# Altium schematic sheet Voeding.SchDoc
size A3; SheetNumber: 2; SheetTotal: 8
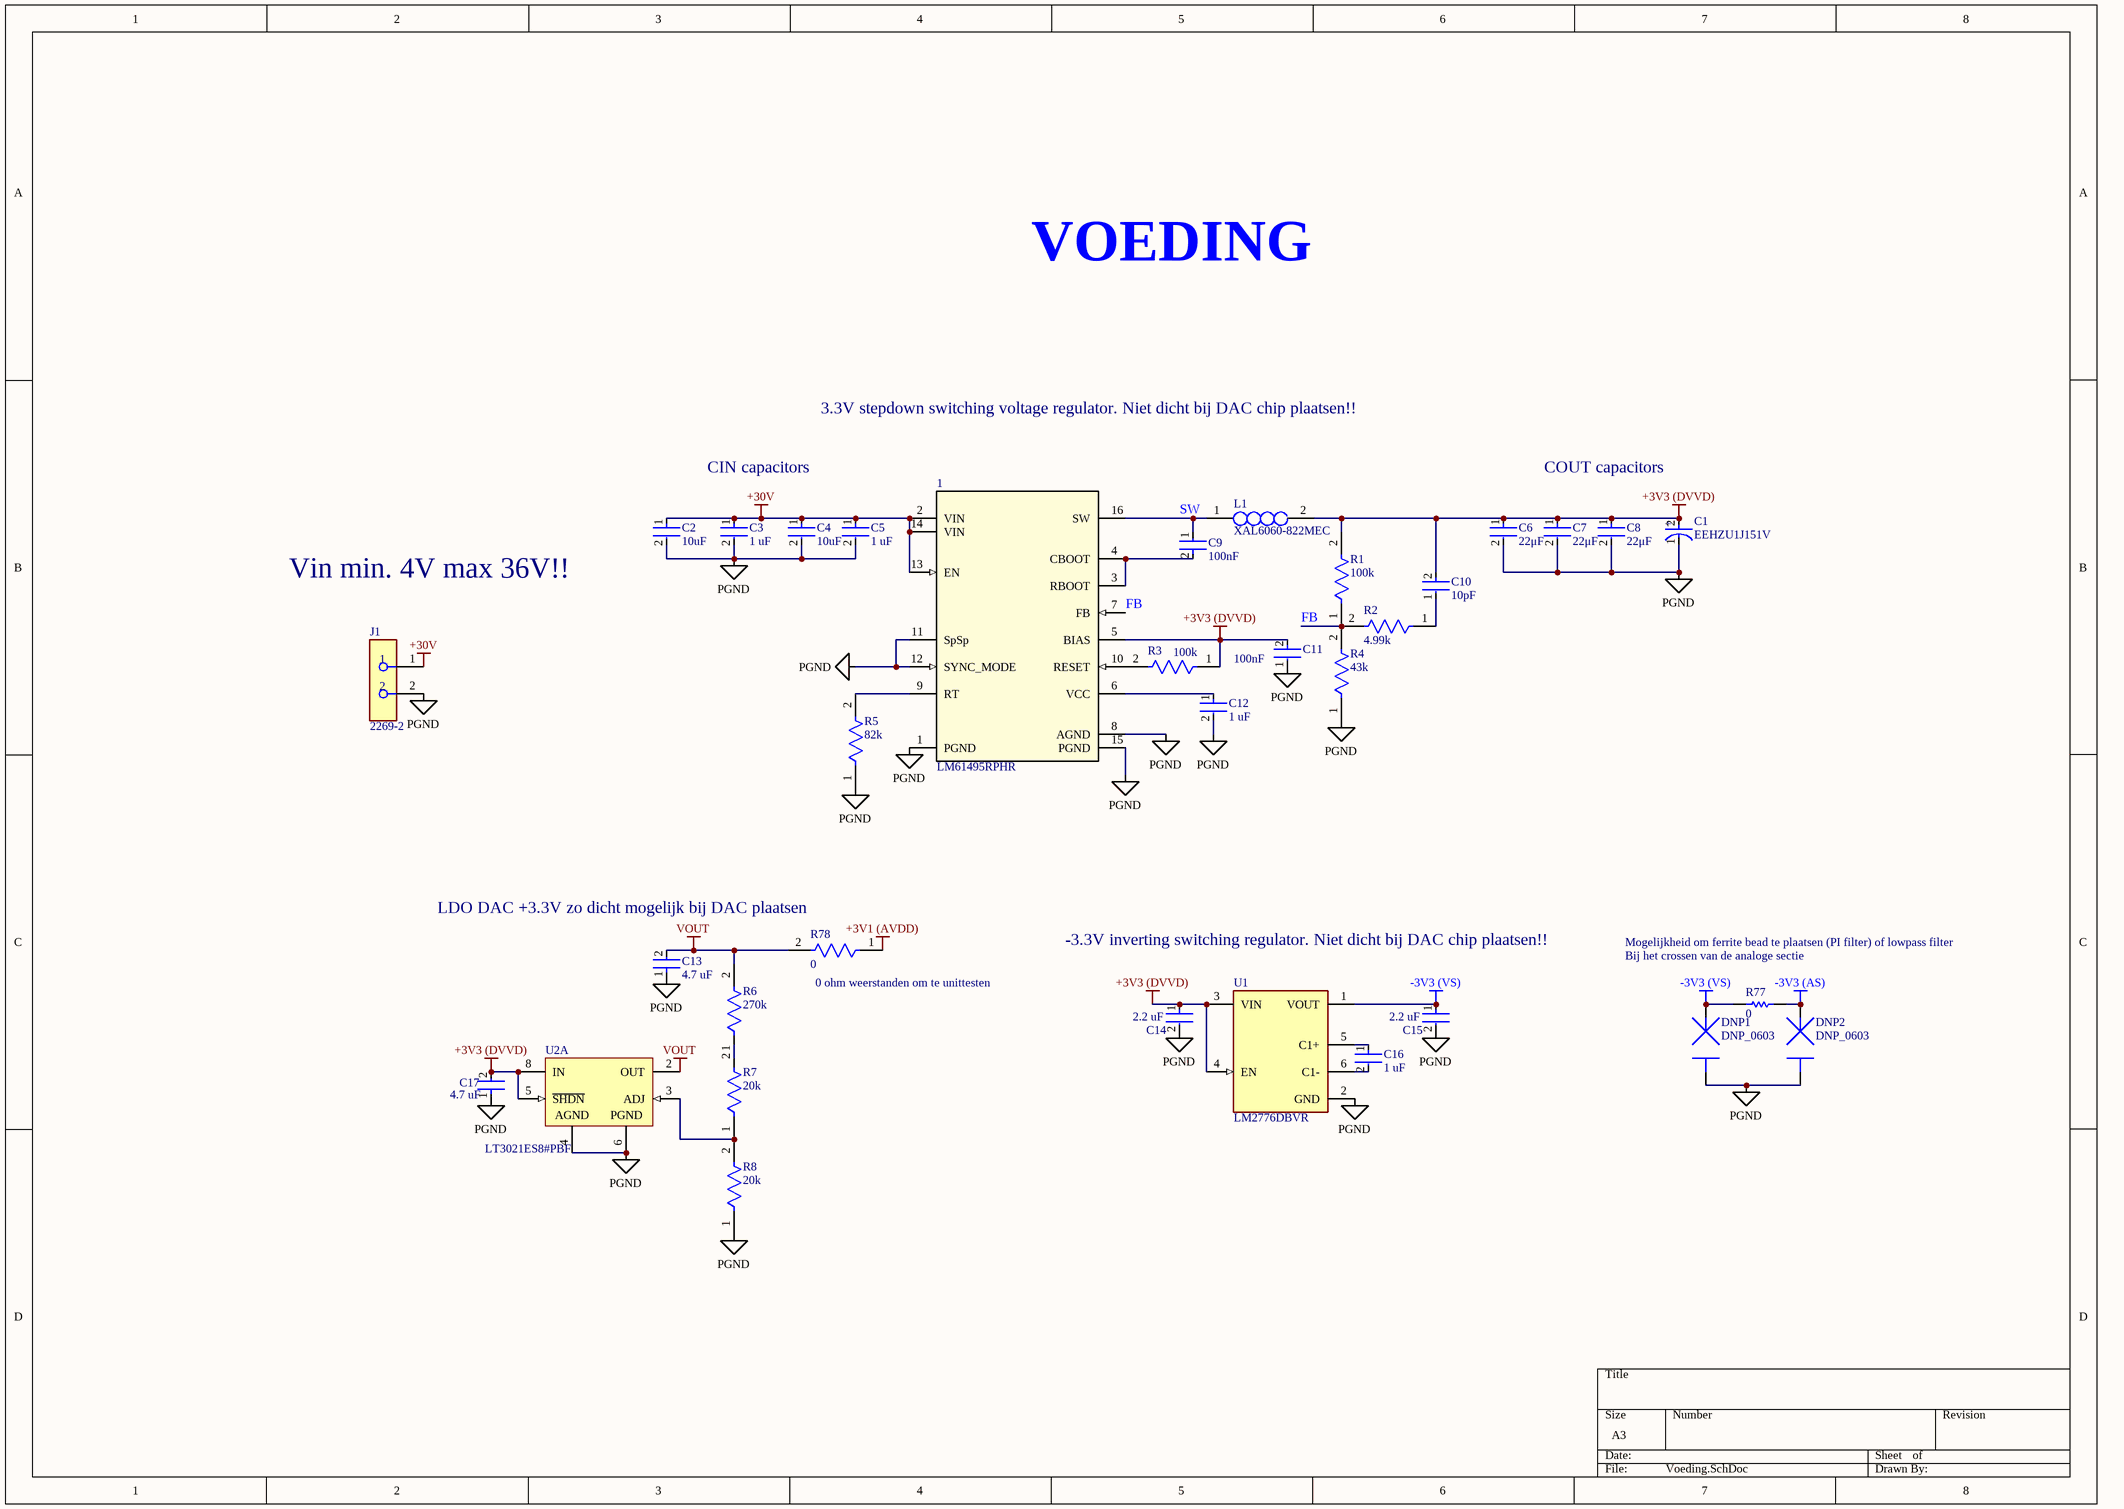
[diagram p0: Voeding.SchDoc]

## Parts
1  LM61495RPHR  [RPH0016A]
C1  EEHZU1J151V  [FP-EEH-G16-V-MFG]
C2  10uF  [FP-GRM32-MFG]
C3  1 uF  [FP-C0603C-CF-MFG]
C4  10uF  [FP-GRM32-MFG]
C5  1 uF  [FP-C0603C-CF-MFG]
C6  22μF  [FP-C2012-125-0_2-MFG]
C7  22μF  [FP-C2012-125-0_2-MFG]
C8  22μF  [FP-C2012-125-0_2-MFG]
C9  100nF  [FP-GRM15-MFG]
C10  10pF  [FP-GRM15-MFG]
C11  100nF  [FP-GRM15-MFG]
C12  1 uF  [FP-C0603C-CF-MFG]
C13  4.7 uF  [FP-C0603C-CF-MFG]
C14  2.2 uF  [FP-C0603C-CF-MFG]
C15  2.2 uF  [FP-C0603C-CF-MFG]
C16  1 uF  [FP-C0603C-CF-MFG]
C17  4.7 uF  [FP-C0603C-CF-MFG]
DNP1  DNP_0603  [DNP_0603_footprint]
DNP2  DNP_0603  [DNP_0603_footprint]
J1  2269-2  [FP-2269-2-MFG]
L1  XAL6060-822MEC  [XAL6060822MEC]
R1  100k  [FP-CRCW0402-C-e3-MFG]
R2  4.99k  [FP-CRCW0402-e3-MFG]
R3  100k  [FP-CRCW0402-C-e3-MFG]
R4  43k  [FP-CRCW0402-C-e3-MFG]
R5  82k  [FP-CRCW0402-C-e3-MFG]
R6  270k  [FP-ERJ6EN-MFG]
R7  20k  [FP-ERJ6EN-MFG]
R8  20k  [FP-ERJ6EN-MFG]
R77  0  [RESC1608X55X25ML10T15]
R78  0  [FP-CRCW1206-MFG]
U1  LM2776DBVR  [FP-DBV0006A-MFG]
U2  LT3021ES8#PBF  [LT-S8-8_L]  (part A of 2)

## Nets
+3V1 (AVDD): R78.1
+3V3 (DVVD): 1.5(BIAS) C1.2(A) C6.1 C7.1 C8.1 C10.2 C11.2 C14.1 C17.2 L1.2 R1.2 R3.1 U1.3(VIN) U1.4(EN) U2.5(~{SHDN}) U2.8(IN)
+30V: 1.2(VIN) 1.13(EN) 1.14(VIN) C2.1 C3.1 C4.1 C5.1 J1.1
-3V3 (AS): DNP2.2 R77.2
-3V3 (VS): C15.1 DNP1.2 R77.1 U1.1(VOUT)
PGND: 1.1(PGND) 1.8(AGND) 1.11(SpSp) 1.12(SYNC_MODE) 1.15(PGND) C1.1(C) C2.2 C3.2 C4.2 C5.2 C6.2 C7.2 C8.2 C11.1 C12.2 C13.1 C14.2 C15.2 C17.1 DNP1.1 DNP2.1 J1.2 R4.1 R5.1 R8.1 U1.2(GND) U2.4(AGND) U2.6(PGND)
VOUT: C13.2 R6.2 R78.2 U2.2(OUT)
FB: 1.7(FB) R1.1 R2.2 R4.2
SW: 1.16(SW) C9.1 L1.1
Net1_3: 1.3(RBOOT) 1.4(CBOOT) C9.2
Net1_6: 1.6(VCC) C12.1
Net1_9: 1.9(RT) R5.2
Net1_10: 1.10(RESET) R3.2
NetC10_1: C10.1 R2.1
NetC16_1: C16.1 U1.5(C1+)
NetC16_2: C16.2 U1.6(C1-)
NetR6_1: R6.1 R7.2
NetR7_1: R7.1 R8.2 U2.3(ADJ)

## Notes on the sheet
- VOEDING
- 3.3V stepdown switching voltage regulator. Niet dicht bij DAC chip plaatsen!!
- CIN capacitors
- COUT capacitors
- Vin min. 4V max 36V!!
- LDO DAC +3.3V zo dicht mogelijk bij DAC plaatsen
- (near R78) 0 ohm weerstanden om te unittesten
- -3.3V inverting switching regulator. Niet dicht bij DAC chip plaatsen!!
- Mogelijkheid om ferrite bead te plaatsen (PI filter) of lowpass filter
- Bij het crossen van de analoge sectie
- (in symbol CMP-05428-001018-1) +

## Library data of the parts
1 = LM61495RPHR: No Description Available; Mfr_Name: Texas Instruments; TYPE: TYPE; RefDes: RefDes
C1 = CMP-05428-001018-1: Aluminum Hybrid Polymer Capacitors 150uF 20% 63V Life 4000Hours AEC-Q200 RADIAL SMT; RoHS Compliant: Yes
C2 C4 = CMP-2000-05261-2: CAP CER 10UF 50V X7R 1210; Manufacturer Part Number: GRM32ER71H106KA12L; Manufacturer: Murata; Tolerance: 10%; Material: Ceramic; Temperature Coefficient: 15%; Voltage Rating: 50V; Temperature Characteristic: X7R; Value: 10uF; ComponentLink2Description: Datasheet; Device Class L1: Passive Components; Lead Free: Yes; Temperature Range High: +125°C; Category: Cap; ComponentLink2URL: https://search.murata.co.jp/Ceramy/image/img/A01X/G101/ENG/GRM32ER71H106KA12-01.pdf; Device Class L2: Capacitors; Package: GRM32; Mouser Description: 1210 10 uF 50 V ±10% Tolerance X7R SMT Multilayer Ceramic Capacitor; Capacitance: 10uF; Octopart: https://octopart.com/grm32er71h106ka12l-murata-10470987; Digikey Description: CAP CER 10UF 50V X7R 1210; Height: 2.7mm; Temperature: -55°C to +125°C; Temperature Range Low: -55°C; RoHS: TRUE; Device Class L3: Ceramic Capacitors; Automotive: No
C3 C5 C12 C16 = CMP-2006-03056-2: CAP CER 1 UF 50V 5% X7R 0603; Manufacturer Part Number: C0603C104J5RACTU; Manufacturer: KEMET; Generic part Eurocircuits:: GPC0603105; Automotive Grade: Grade 1; Tolerance: 0.05; Capacitance: 1 μF; Value: 1 μF; Material: Ceramic; Temperature Coefficient: 30ppm/°C; ComponentLink2Description: Datasheet; Voltage Rating: 50 V; Digikey Description: CAP CER 0.1UF 50V 5% X7R 0603; Temperature Range High: +125°C; Device Class L2: Capacitors; Octopart: https://octopart.com/c0603c104j5ractu-kemet-10440638; RoHS: TRUE; Mouser Description: Multilayer Ceramic Capacitors MLCC - SMD/SMT 50volts 0.1uF X7R 5%; Temperature Range Low: -55°C; Automotive: Yes; Lead Free: Yes; ComponentLink2URL: https://api.kemet.com/component-edge/download/datasheet/C0603C100J5GACAUTO.pdf; Device Class L3: Ceramic Capacitors; Package: C0603C-CF; Category: Cap; Temperature: -55°C to +125°C; Height: 0.87mm; Temperature Characteristic: X7R; Device Class L1: Passive Components
C6-C8 = CMP-08246-005813-1: Multilayer Ceramic Capacitors 22μF ±20% 10V X5R SMD 0805; Capacitance: 22uF; Termination: SMD/SMT; Width: 0.049inch; Dielectric: X5R; Tolerance: 20%; Resistor Type: Ceramic; Construction: Flat; Package Quantity: 1; Mount: Surface Mount; Packaging: Tape and Reel; Case Code (Imperial): 0805; Dielectric Material: Ceramic; Case/Package: 0805; Series: C; Voltage Rating (DC): 10V; Min Operating Temperature: -55°C; Lead Free: Lead Free; Weight: 0.000194oz; Thickness: 0.057inch; RoHS Compliant: Yes; REACH SVHC: No SVHC; Depth: 1.25mm; Max Operating Temperature: 85°C; Length: 2mm; Number of Pins: 2; Case Code (Metric): 2012; Voltage Rating: 10V; Height: 1.25mm
C9 C11 = CMP-2100-03641-2: CAP CER 0.1UF 16V X7R 0402; Manufacturer Part Number: GRM155R71C104KA88D; Manufacturer: Murata; Standoff Height: 0mm; Tolerance: 10%; Voltage Rating: 16Vdc; Material: Ceramic; Capacitance: 0.10μF; Value: 0.10μF; RoHS: TRUE; Temperature Characteristic: X7R; Octopart: https://octopart.com/grm155r71c104ka88d-murata-196880; Digikey Description: CAP CER 0.1UF 16V X7R 0402; Device Class L3: Ceramic Capacitors; Height: 0.55mm; ComponentLink2Description: Datasheet; Temperature Range Low: -55°C; Ipc Land Pattern Name: CAPC10050X219; ComponentLink2URL: https://search.murata.co.jp/Ceramy/image/img/A01X/G101/ENG/GRM155R71H471KA01-01A.pdf; Device Class L1: Passive Components; Lead Free: yes; Category: Cap; Package: GRM15; Temperature: -55°C to +125°C; Device Class L2: Capacitors; Temperature Range High: +125°C; Mouser Description: 0402 0.1 uF 16V ±10 % Tolerance X7R SMT Multilayer Ceramic Capacitor
C10 = CMP-2100-03641-2: CAP CER 10pF 16V X7R 0402; Manufacturer Part Number: GRM155R71C104KA88D; Manufacturer: Murata; Standoff Height: 0mm; Tolerance: 10%; Voltage Rating: 16Vdc; Material: Ceramic; RoHS: TRUE; Temperature Characteristic: X7R; Octopart: https://octopart.com/grm155r71c104ka88d-murata-196880; Digikey Description: CAP CER 0.1UF 16V X7R 0402; Device Class L3: Ceramic Capacitors; Height: 0.55mm; ComponentLink2Description: Datasheet; Temperature Range Low: -55°C; Ipc Land Pattern Name: CAPC10050X219; ComponentLink2URL: https://search.murata.co.jp/Ceramy/image/img/A01X/G101/ENG/GRM155R71H471KA01-01A.pdf; Device Class L1: Passive Components; Lead Free: yes; Category: Cap; Package: GRM15; Temperature: -55°C to +125°C; Device Class L2: Capacitors; Capacitance: 10pF; Value: 10pF; Temperature Range High: +125°C; Mouser Description: 0402 0.1 uF 16V ±10 % Tolerance X7R SMT Multilayer Ceramic Capacitor
C13 C17 = CMP-2006-03056-2: CAP CER 4.7 UF 50V 5% X7R 0603; Manufacturer Part Number: C0603C104J5RACTU; Manufacturer: KEMET; Generic part Eurocircuits:: GPC0603475-10; Automotive Grade: Grade 1; Tolerance: 0.05; Capacitance: 4.7 μF; Value: 4.7 μF; Material: Ceramic; Temperature Coefficient: 30ppm/°C; ComponentLink2Description: Datasheet; Voltage Rating: 50 V; Digikey Description: CAP CER 0.1UF 50V 5% X7R 0603; Temperature Range High: +125°C; Device Class L2: Capacitors; Octopart: https://octopart.com/c0603c104j5ractu-kemet-10440638; RoHS: TRUE; Mouser Description: Multilayer Ceramic Capacitors MLCC - SMD/SMT 50volts 0.1uF X7R 5%; Temperature Range Low: -55°C; Automotive: Yes; Lead Free: Yes; ComponentLink2URL: https://api.kemet.com/component-edge/download/datasheet/C0603C100J5GACAUTO.pdf; Device Class L3: Ceramic Capacitors; Package: C0603C-CF; Category: Cap; Temperature: -55°C to +125°C; Height: 0.87mm; Temperature Characteristic: X7R; Device Class L1: Passive Components
C14 C15 = CMP-2006-03056-2: CAP CER 2.2 UF 50V 5% X7R 0603; Manufacturer Part Number: C0603C104J5RACTU; Manufacturer: KEMET; Generic part Eurocircuits:: GPC0603105; Automotive Grade: Grade 1; Tolerance: 0.05; Capacitance: 2.2 μF; Value: 2.2 μF; Material: Ceramic; Temperature Coefficient: 30ppm/°C; ComponentLink2Description: Datasheet; Voltage Rating: 50 V; Digikey Description: CAP CER 0.1UF 50V 5% X7R 0603; Temperature Range High: +125°C; Device Class L2: Capacitors; Octopart: https://octopart.com/c0603c104j5ractu-kemet-10440638; RoHS: TRUE; Mouser Description: Multilayer Ceramic Capacitors MLCC - SMD/SMT 50volts 0.1uF X7R 5%; Temperature Range Low: -55°C; Automotive: Yes; Lead Free: Yes; ComponentLink2URL: https://api.kemet.com/component-edge/download/datasheet/C0603C100J5GACAUTO.pdf; Device Class L3: Ceramic Capacitors; Package: C0603C-CF; Category: Cap; Temperature: -55°C to +125°C; Height: 0.87mm; Temperature Characteristic: X7R; Device Class L1: Passive Components
DNP1 DNP2 = DNP_0603: Is just 0603 footprint. So that you can solder 0603 components on it after you ordered youre PCB.
J1 = CMP-73906-000010-1: CONN DBL BANANA JACK TURRET; Voltage Rating (DC): 70V; Max Current Rating: 15A; Number of Contacts: 2; Voltage Rating: 2.5kV; Body Material: PC; Gender: Female; Insulation: Mating End Insulated; Housing Color: Red; Insulation Material: Polycarbonate; Contact Material: Brass; Termination: Solder; Height: 0.375inch; Orientation: Straight; Lead Free: Lead Free; Length: 24inch; Depth: 16mm; Current Rating: 15A; Width: 4inch; Contact Plating: Tin; Weight: 0.033lb; RoHS Compliant: Yes; REACH SVHC: No SVHC; Package Quantity: 5; Number of Ports: 2; Color: Red; Housing Material: Polycarbonate; Packaging: Bulk; Mount: Panel
L1 = XAL6060-822MEC: 8.2 uH Inductor; Manufacturer_Name: COILCRAFT; Datasheet Link: https://www.coilcraft.com/getmedia/ea51f14b-7f32-4dc6-8dfe-d4b70549040f/xal60xx.pdf; Height: 6.1mm; Manufacturer_Part_Number: XAL6060-822MEC; Mouser Part Number: 994-XAL6060-822MEC; Mouser Price/Stock: https://www.mouser.co.uk/ProductDetail/Coilcraft/XAL6060-822MEC?qs=zCSbvcPd3pZnGF7hddsKzw%3D%3D
R1 R3 R5 = CMP-02407-010951-1: RES 100K OHM 1% 1/16W 0402; Temperature Coefficient: 100ppm/°C; Power Rating: 62.5mW; Resistance: 100kR; Lead Free: Lead Free; Length: 1mm; Tolerance: 1%; Resistor Type: Thick Film; Contact Plating: Tin; Case/Package: SMD/SMT; Min Operating Temperature: -55°C; RoHS Compliant: Yes; Termination: Wraparound; Max Operating Temperature: 155°C; Mount: Surface Mount
R2 = CMP-2002-00057-2: RES Thick Film, 4.99kΩ, 1%, 0.063W, 100ppm/°C, 0402; Power Rating: 63mW; Resistance: 4.99kR; Voltage Rating: 50V; Package Quantity: 10; Max Power Dissipation: 63mW; Temperature Coefficient: 100ppm/°C; Lead Free: Lead Free; Mount: Surface Mount; Height: 0.35mm; Number of Terminations: 2; Contact Plating: Tin; Case/Package: 0402; Max Operating Temperature: 155°C; Case Code (Imperial): 0402; Weight: 2.3E-05oz; Width: 0.5mm; Features: Automotive AEC-Q200; Voltage Rating (DC): 50V; Tolerance: 1%; Min Operating Temperature: -55°C; Length: 1mm; Depth: 0.5mm; Military Standard: Not; Packaging: Tape and Reel; Radiation Hardening: No; Composition: Thick Film; Termination: SMD/SMT; Case Code (Metric): 1005
R4 = CMP-02407-010951-1: RES 43k OHM 1% 1/16W 0402; Temperature Coefficient: 100ppm/°C; Power Rating: 62.5mW; Lead Free: Lead Free; Length: 1mm; Tolerance: 1%; Resistor Type: Thick Film; Contact Plating: Tin; Case/Package: SMD/SMT; Min Operating Temperature: -55°C; RoHS Compliant: Yes; Termination: Wraparound; Max Operating Temperature: 155°C; Mount: Surface Mount; Resistance: 43k
R6-R8 = CMP-2001-00027-2: RES SMD 20K OHM 1% 1/8W 0805; Temperature Coefficient: 100ppm/°C; Voltage Rating: 150V; Power Rating: 125mW; Resistance: 20kR; Max Operating Temperature: 155°C; Number of Terminations: 2; RoHS Compliant: Yes; Case Code (Imperial): 0805; Packaging: Tape and Reel; Construction: Rectangular; Series: ERJ; Resistor Type: Thick Film; Lead Free: Lead Free; Package Quantity: 1; Case/Package: 0805; Features: Automotive AEC-Q200; REACH SVHC: No SVHC; Technology: THICK FILM; Width: 0.049inch; Length: 2mm; Depth: 1.25mm; Min Operating Temperature: -55°C; Case Code (Metric): 2012; Contact Plating: Tin; Termination: SMD/SMT; Resistance Tolerance: 1%; Height: 0.6mm; Working Voltage: 150V; Military Standard: Not; Max Power Dissipation: 125mW; Radiation Hardening: No; Tolerance: 1%; Voltage Rating (DC): 150V; Mount: Surface Mount
R77 = CMP-2100-03667-1: Chip Resistor, 0 Ohm, +/- 5%, 0.1 W, -55 to 155 degC, 0603 (1608 Metric), RoHS, Tape and Reel; Manufacturer: Yageo; Temperature Coefficient: 200ppm/degreesC; Voltage Rating: 50V; Power Rating: 100mW; Resistance: 0mOhm; Width: 0.8mm; Max Operating Temperature: 155degC; Tolerance: 5%; Package Reference: 0603; Height: 0.45mm; Depth: 0.8mm; Package Description: 2-Pin Surface Mount Device, Body 1.6 x 0.8 mm; Termination: SMD/SMT; Package Quantity: 5000; Case/Package: 0603; Case Code (Imperial): 0603; Radiation Hardening: No; Number of Pins: 2; Length: 1.6mm; Lead Free: LeadFree; Voltage Rating (DC): 50V; Military Standard: Not; Datasheet URL: http://www.yageo.com/NewPortal/yageodocoutput?fileName=/pdf/R-Chip/PYu-RC_Group_51_RoHS_L_5.pdf; Manufacturer URL: http://www.yageo.com/; Packaging: TapeandReel; Case Code (Metric): 1608; Min Operating Temperature: -55degC; Composition: ThickFilm; RoHSCompliant: true; Contact Plating: Tin; Datasheet Version: Rev. 5, 10/2016; REACH SVHC: NoSVHC
R78 = CMP-00030-39388935-1: CRCW12060000ZSTA Zero Ohm Resistor, Jumper, 1206 [3216 Metric], Thick Film, 250 mW, Surface Mount; Voltage Rating (DC): 200V; Max Power Dissipation: 250mW; Temperature Coefficient: 100ppm/°C; Resistance: 0Ω; Packaging: Cut Tape; Lead Free: Contains Lead; Height: 609.6µm; Military Standard: Not; Min Operating Temperature: -55°C; Weight: 10.007382mg; Depth: 1.6mm; Termination: SMD/SMT; Mount: Surface Mount; RoHS: Compliant; Case Code (Metric): 3216; Max Operating Temperature: 155°C; NexarPartId: 39388935; Length: 3.2mm; Features: Automotive AEC-Q200; Case Code (Imperial): 1206; Composition: Thick Film; Case/Package: 1206; Voltage Rating: 200V; Width: 1.6mm; Contact Plating: Lead, Tin; Number of Terminations: 2; REACH SVHC: Unknown; Power Rating: 250mW; Radiation Hardening: No
U1 = CMP-04918-000109-1: IC REG CHARGE PUMP INV SOT23; Manufacturer: Texas Instruments; Nominal Supply Current: 100uA; Switching Frequency: 2MHz; Number Of Outputs: 1; Standoff Height: 0mm; Min Supply Voltage: 2.7V; Output Current: 200mA; Max Supply Voltage: 5.5V; Output Type: Fixed; Max Junction Temp: +125°C; Negative Voltage Available: true; Output Voltage: -2.7-5.5V; Device Class L2: Power Management ICs; Temperature: -40°C to +85°C; Digikey Description: IC REG CHARGE PUMP INV SOT23; Octopart: https://octopart.com/lm2776dbvr-texas+instruments-58839919; Package: DBV0006A; ComponentLink2Description: Datasheet; Manufacturer Part Number: LM2776DBVR; Ambient Temperature Range Low: -40°C; RoHS: TRUE; Temperature Range Low: -40°C; Lead Free: Yes; Automotive: No; Ambient Temperature Range High: +85°C; Device Class L1: Integrated Circuits (ICs); Category: IC; Device Class L3: Voltage Regulators - Switching; Switching Topology: Charge Pump; Height: 1.45mm; ComponentLink2URL: http://www.ti.com/lit/ds/symlink/lm2776.pdf; Temperature Range High: +85°C
U2 = CMP-0476-01501-1: Low 160 mV Dropout Voltage, Internal PNP Pass Element, 200 mV Reference Voltage, 0.9 to 10 V Vin, Adjustable Vout, 8-pin SOIC (S8-8), -40 to 125 degC, Pb-Free; Manufacturer: Linear Technology; Vin Min(V): 0.9; Noise(uV): 300; Isupply(mA): 0.12; Number of Outputs: 1; Output Voltage: Adj; Vout Min(V): 0.2; PSRR(dB): 70; Discrete Pass Element: no; Iout(mA): 500; Vin Max(V): 10; Dropout Voltage(V): 0.155; Vout Max(V): 9.8; Shutdown Current(uA): 3; ComponentLink1Description: Manufacturer URL; ComponentLink3Description: Package Specification; ComponentLink3URL: http://cds.linear.com/docs/en/packaging/05081610_G_SO8.pdf; Mounting Technology: Surface Mount; DatasheetVersion: Rev. C; PackageVersion: Rev. G, 03/2012; ComponentLink2Description: Datasheet; ComponentLink1URL: http://www.linear.com/; PackageReference: S8-8; PartNumber: LT3021ES8#PBF; RoHS: TRUE; PackageDescription: 8-Pin Plastic Small Outline (Narrow .150 Inch), Body 4.9 x 3.9 mm, Pitch 1.27 mm; ComponentLink2URL: http://cds.linear.com/docs/en/datasheet/3021fc.pdf